# Altium schematic sheet mcu.SchDoc
size A3; SheetNumber: 1; SheetTotal: 4
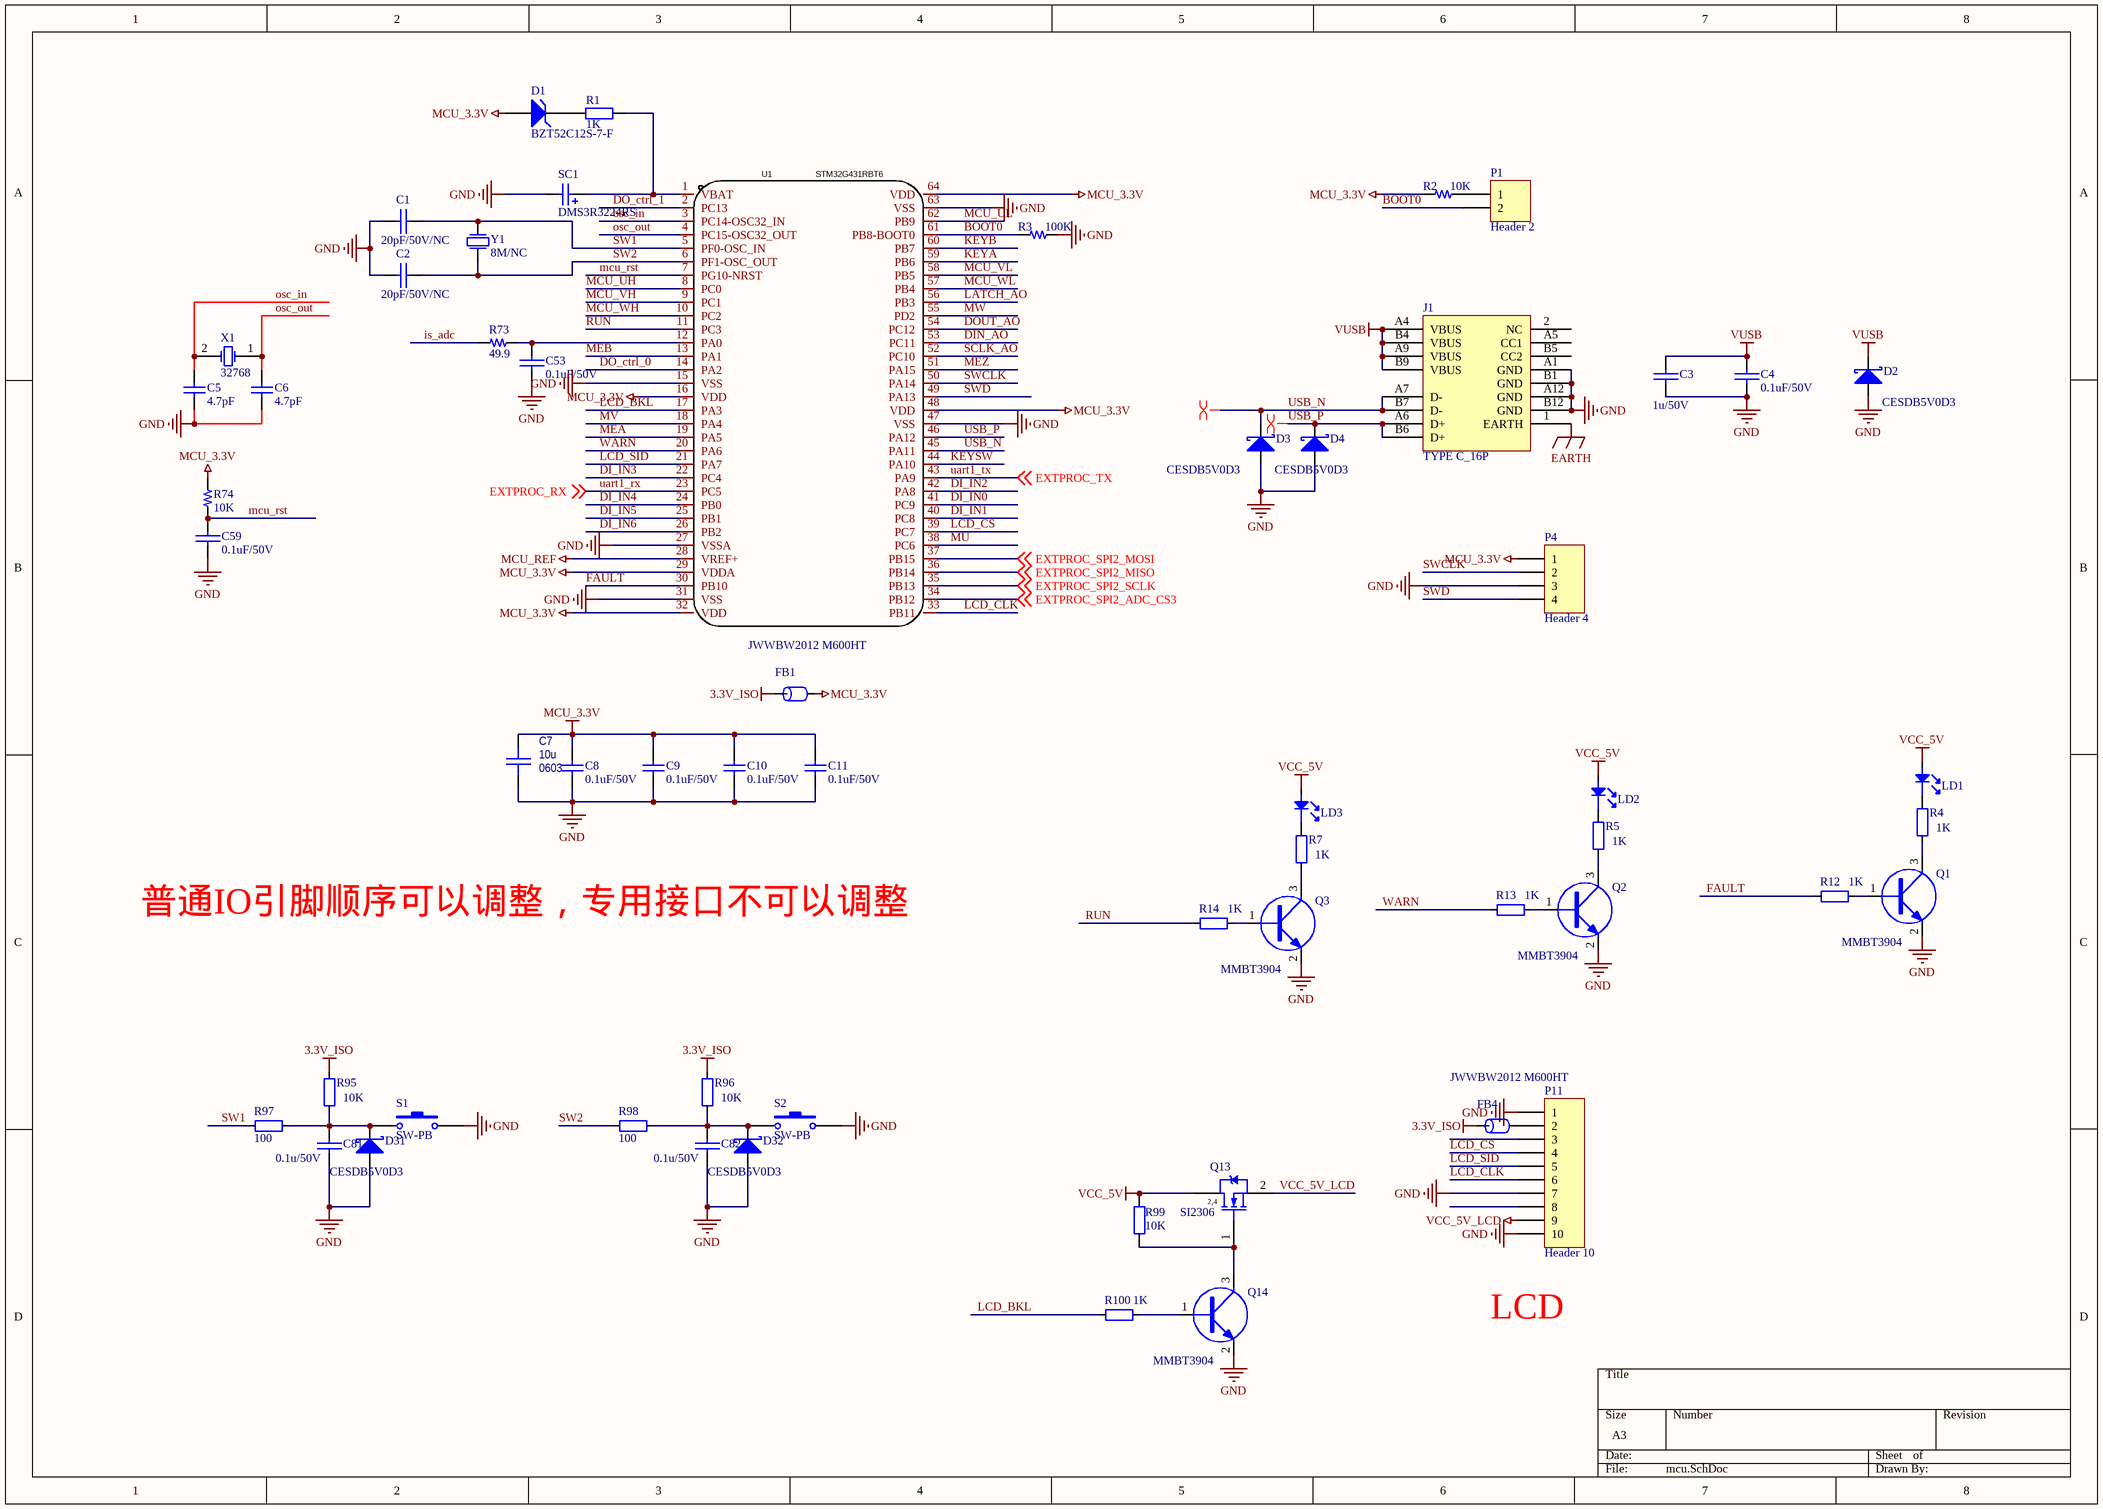
[diagram p0: mcu.SchDoc]

## Parts
C1  value 20pF/50V/NC  [0603C]  (hidden comment: 20pF/25V/NC)  (no BOM)
C2  value 20pF/50V/NC  [0603C]  (hidden comment: 20pF/25V/NC)  (no BOM)
C3  value 1u/50V  [0603C]  (hidden comment: 1uF/25V)
C4  0.1uF/50V  [0603C]
C5  4.7pF  [0603C]
C6  4.7pF  [0603C]
C7  value 10u  Package: 0603  [CAPC1608X092N_0603]  (hidden comment: Capacitor_0603)
C8  0.1uF/50V  [0603C]
C9  0.1uF/50V  [0603C]
C10  0.1uF/50V  [0603C]
C11  0.1uF/50V  [0603C]
C53  0.1uF/50V  [0603C]
C59  0.1uF/50V  [0603C]
C81  value 0.1u/50V  [0603C]  (hidden comment: 1uF/25V)
C82  value 0.1u/50V  [0603C]  (hidden comment: 1uF/25V)
D1  BZT52C12S-7-F  [DIOD-SOD323-2_V]
D2  CESDB5V0D3  [SOD323]
D3  CESDB5V0D3  [SOD323]
D4  CESDB5V0D3  [SOD323]
D31  CESDB5V0D3  [SOD323]
D32  CESDB5V0D3  [SOD323]
FB1  JWWBW2012 M600HT  [0805R]
FB4  JWWBW2012 M600HT  [0805R]
J1  TYPE C_16P  [TYPEC_16P]
LD1  LED_Green_19-217  [0603led]  (value not drawn)
LD2  LED_Green_19-217  [0603led]  (value not drawn)
LD3  LED_Green_19-217  [0603led]  (value not drawn)
P1  Header 2  [HDR1X2]
P4  Header 4  [HDR1X4]
P11  Header 10  [HDR1X10]
Q1  MMBT3904  [SOT23-3]
Q2  MMBT3904  [SOT23-3]
Q3  MMBT3904  [SOT23-3]
Q13  SI2306  [SOT23-3]
Q14  MMBT3904  [SOT23-3]
R1  1K  [0603R]  (no BOM)
R2  10K  [0603R]
R3  100K  [0603R]
R4  1K  [0603r]
R5  1K  [0603r]
R7  1K  [0603r]
R12  1K  [0603r]
R13  1K  [0603r]
R14  1K  [0603r]
R73  49.9  [0603R]
R74  10K  [0603R]
R95  10K  [0603r]
R96  10K  [0603r]
R97  100  [0603r]
R98  100  [0603r]
R99  10K  [0603R]
R100  1K  [0603r]
S1  SW-PB  [SPST-2]
S2  SW-PB  [SPST-2]
SC1  DMS3R3224RS  [CAP-TH_DMS3R3224]
U1  STM32G431RBT6  [LQFP-64]
X1  32768  [A]
Y1  8M/NC  [CRAY_5032]  (no BOM)

## Nets
3.3V_ISO: FB1.1 FB4.1 R95.1 R96.1
EARTH: J1.1(EARTH)
GND: C1.2 C2.2 C3.1 C4.1 C5.2 C6.2 C7.2 C8.1 C9.1 C10.1 C11.1 C53.1 C59.1 C81.1 C82.1 D2.1(A) D3.1(A) D4.1(A) D31.1(A) D32.1(A) J1.A1(GND) J1.A12(GND) J1.B1(GND) J1.B12(GND) P4.3 P11.1 P11.7 P11.10 Q1.2(E) Q2.2(E) Q3.2(E) Q14.2(E) R3.2 S1.2 S2.2 SC1.2 U1.15(VSS) U1.27(VSSA) U1.31(VSS) U1.47(VSS) U1.63(VSS)
MCU_3.3V: C7.1 C8.2 C9.2 C10.2 C11.2 D1.1(A) FB1.2 P4.1 R2.1 R74.1 U1.16(VDD) U1.29(VDDA) U1.32(VDD) U1.48(VDD) U1.64(VDD)
MCU_REF: U1.28(VREF+)
VCC_5V: LD1.1 LD2.1 LD3.1 Q13.3(D) R99.2
VCC_5V_LCD: P11.9 Q13.2(S)
VUSB: C3.2 C4.2 D2.2(K) J1.A4(VBUS) J1.A9(VBUS) J1.B4(VBUS) J1.B9(VBUS)
BOOT0: P1.2 R3.1 U1.61(PB8-BOOT0)
DI_IN0: U1.41(PC9)
DI_IN1: U1.40(PC8)
DI_IN2: U1.42(PA8)
DI_IN3: U1.22(PC4)
DI_IN4: U1.24(PB0)
DI_IN5: U1.25(PB1)
DI_IN6: U1.26(PB2)
DIN_AO: U1.53(PC11)
DO_ctrl_0: U1.14(PA2)
DO_ctrl_1: U1.2(PC13)
DOUT_AO: U1.54(PC12)
EXTPROC_SPI2_ADC_CS3: U1.34(PB12) ; off-sheet EXTPROC_SPI2_ADC_CS3
EXTPROC_SPI2_MISO: U1.36(PB14) ; off-sheet EXTPROC_SPI2_MISO
EXTPROC_SPI2_MOSI: U1.37(PB15) ; off-sheet EXTPROC_SPI2_MOSI
EXTPROC_SPI2_SCLK: U1.35(PB13) ; off-sheet EXTPROC_SPI2_SCLK
FAULT: R12.1 U1.30(PB10)
is_adc: R73.1
KEYA: U1.59(PB6)
KEYB: U1.60(PB7)
KEYSW: U1.44(PA10)
LATCH_AO: U1.56(PB3)
LCD_BKL: R100.1 U1.17(PA3)
LCD_CLK: P11.6 U1.33(PB11)
LCD_CS: P11.4 U1.39(PC7)
LCD_SID: P11.5 U1.21(PA7)
mcu_rst: C59.2 R74.2 U1.7(PG10-NRST)
MCU_UH: U1.8(PC0)
MCU_UL: U1.62(PB9)
MCU_VH: U1.9(PC1)
MCU_VL: U1.58(PB5)
MCU_WH: U1.10(PC2)
MCU_WL: U1.57(PB4)
MEA: U1.19(PA5)
MEB: U1.13(PA1)
MEZ: U1.51(PA15)
MU: U1.38(PC6)
MV: U1.18(PA4)
MW: U1.55(PD2)
osc_in: C5.1 U1.3(PC14-OSC32_IN) X1.2(OSC2)
osc_out: C6.1 U1.4(PC15-OSC32_OUT) X1.1(OSC1)
RUN: R14.1 U1.11(PC3)
SCLK_AO: U1.52(PC10)
SW1: C1.1 R97.1 U1.5(PF0-OSC_IN) Y1.1(P1)
SW2: C2.1 R98.1 U1.6(PF1-OSC_OUT) Y1.2(P2)
SWCLK: P4.2 U1.50(PA14)
SWD: P4.4 U1.49(PA13)
uart1_rx: U1.23(PC5) ; off-sheet EXTPROC_RX  [also labelled EXTPROC_RX]
uart1_tx: U1.43(PA9) ; off-sheet EXTPROC_TX  [also labelled EXTPROC_TX]
USB_N: D3.2(K) J1.A7(D-) J1.B7(D-) U1.45(PA11)
USB_P: D4.2(K) J1.A6(D+) J1.B6(D+) U1.46(PA12)
WARN: R13.1 U1.20(PA6)
NetC53_2: C53.2 R73.2 U1.12(PA0)
NetC81_2: C81.2 D31.2(K) R95.2 R97.2 S1.1
NetC82_2: C82.2 D32.2(K) R96.2 R98.2 S2.1
NetD1_2: D1.2(K) R1.1
NetFB4_2: FB4.2 P11.2
NetLD1_2: LD1.2 R4.1
NetLD2_2: LD2.2 R5.1
NetLD3_2: LD3.2 R7.1
NetP1_1: P1.1 R2.2
NetQ1_1: Q1.1(B) R12.2
NetQ1_3: Q1.3(C) R4.2
NetQ2_1: Q2.1(B) R13.2
NetQ2_3: Q2.3(C) R5.2
NetQ3_1: Q3.1(B) R14.2
NetQ3_3: Q3.3(C) R7.2
NetQ13_1: Q13.1(G) Q14.3(C) R99.1
NetQ14_1: Q14.1(B) R100.2
NetR1_2: R1.2 SC1.1 U1.1(VBAT)

Not connected (* = marked no-connect by the designer): J1 2(NC) A5(CC1) B5(CC2); P11 3 8

## Layout directives
differential pair: USB_N, USB_P

## Notes on the sheet
- 普通IO引脚顺序可以调整，专用接口不可以调整
- LCD
- (in symbol BUK92150-55A) 2,4

## Library data of the parts
C1-C4 C53 C59 C81 C82 = CAP
  C4 C53 C59: Value: 0.1uF/50V
C5 = Cap: Capacitor; Value: 6.8pF; Published: 8-Jun-2000; LatestRevisionDate: 17-Jul-2002; LatestRevisionNote: Re-released for DXP Platform.; PackageReference: RAD-0.3; Publisher: Altium Limited; PackageDescription: Radial Cap, Thru-Hole; 2 Leads; 0.3 in Pin Spacing
C6 = Cap: Capacitor; Published: 8-Jun-2000; LatestRevisionDate: 17-Jul-2002; LatestRevisionNote: Re-released for DXP Platform.; PackageReference: RAD-0.3; Publisher: Altium Limited; PackageDescription: Radial Cap, Thru-Hole; 2 Leads; 0.3 in Pin Spacing
C7 = Capacitor_0603: Capacitor, MLCC; Manufacturer: Murata Electronics; PartNumber: GRM188R61A106KE69D; Tolerance: [tol]; TempCo: [tempco]; Voltage Rating: [voltage]; Supplier 1: *; ComponentLink1URL: *; Supplier Part Number 1: *; ComponentLink1Description: Datasheet; SupplierDescription: CAP CER 10UF 10V X5R 0603
C8-C11 = Cap: Capacitor; Value: 22nF; Published: 8-Jun-2000; LatestRevisionDate: 17-Jul-2002; LatestRevisionNote: Re-released for DXP Platform.; PackageReference: RAD-0.3; Publisher: Altium Limited; PackageDescription: Radial Cap, Thru-Hole; 2 Leads; 0.3 in Pin Spacing
D1 = BZT52C12S-7-F: Zener Current: 5mA; Vz - Zener Voltage: 12V; Pd - Power Dissipation: 200mW; Zz - Zener Impedance: 40Ohms; Unit Weight: 0.000173oz; Voltage Temperature Coefficient: 0.25mV/C; Voltage Tolerance: 5%; Package Reference: SOD323-2; Minimum Operating Temperature: -65C; Packaging: Reel; Product Category: ZenerDiodes; Termination Style: SMD/SMT; Mounting Style: SMD/SMT; RoHS: True; Package / Case: SOD-323; Package Description: 2-Pin Surface Mount Device, Body 1.7 x 1.3 mm; Width: 1.4mm; Mounting Technology: SurfaceMount; Package URL: http://www.vishay.com/docs/71192/71192.pdf; Series: BZT52C12; Value: BZT52C12S-7-F
D2 D3 = DIODE S
D4 D31 D32 = DIODE S: Value: 0.1uF/50V
FB1 FB4 = FB: Part Field 1: 磁珠/0603/1K ohm/100MHz; FB: BLM18BD102SN1(muRata); Text Field1: FB
LD1-LD3 = LED_Green_19-217: 物料主编码(PN): 100000032; Value: 19-217/G7C-AN1P2/3T; ID: 6; 序号: 33; 物料名称: 绿色LED; 物料描述: Other,LED,绿色,0603,1.6X0.8X0.4mm,19-217/G7C-AN1P2/3T; 工作温度: –40°C to 85°C; 制造商: Everlight; 器件等级: ——; 物料类型: 特殊二极管; 规格型号(完整型号): 19-217/G7C-AN1P2/3T
P11 = Header 10: Header, 10-Pin; LatestRevisionDate: 17-Jul-2002; LatestRevisionNote: Re-released for DXP Platform.; Publisher: Altium Limited
Q1-Q3 Q14 = NPN_MMBT3904
Q13 = BUK92150-55A: Published: 8-Jun-2000; LatestRevisionDate: 17-Jul-2002; LatestRevisionNote: Re-released for DXP Platform.; DatasheetVersion: 6-Oct-1997; PackageVersion: Aug-1998; PackageReference: TSOP-6; Publisher: Altium Limited; PackageDescription: SOT-457/SC-74; 6 Leads; Body 3.1 x 3 mm, inc. leads (LxW max); ComponentLink1Description: Manufacturer Link; ComponentLink1URL: http://www.vishay.com/; ComponentLink2Description: Datasheet; ComponentLink2URL: http://www.vishay.com/docs/70192/70192.pdf
R1 = Res0805M
R2 R3 R73 R74 = R: Value: 10k/1%
R4 R5 R7 R12-R14 R100 = RES0603: 物料主编码(PN): 150000040; ID: 233; 序号: 109; 物料名称: 贴片电阻; 精度: ±1%; 规格型号(完整型号): RC1608F103CS/RC0603FR-0710KL; 物料描述: RES,贴片电阻,0603,10k,±1%,1/10W,1.6X0.8X0.45mm,RC1608F103CS/RC0603FR-0710KL; 工作温度: –55°C to 155°C; 制造商: 三星/YAGEO; 器件等级: ——; 物料类型: 表贴电阻; 参数值: 1.00E+04; Value: 1K
R95-R98 = RES0603: 物料主编码(PN): 150000040; Value: 1K; ID: 233; 序号: 109; 物料名称: 贴片电阻; 精度: ±1%; 规格型号(完整型号): RC1608F103CS/RC0603FR-0710KL; 物料描述: RES,贴片电阻,0603,10k,±1%,1/10W,1.6X0.8X0.45mm,RC1608F103CS/RC0603FR-0710KL; 工作温度: –55°C to 155°C; 制造商: 三星/YAGEO; 器件等级: ——; 物料类型: 表贴电阻; 参数值: 1.00E+04
R99 = Res2: Resistor; Value: 10R; Published: 8-Jun-2000; LatestRevisionDate: 17-Jul-2002; LatestRevisionNote: Re-released for DXP Platform.; PackageReference: AXIAL-0.4; Publisher: Altium Limited
S1 S2 = SW-PB: Switch; Published: 24-Mar-1999; LatestRevisionDate: 17-Jul-2002; LatestRevisionNote: Re-released for DXP Platform.; PackageReference: SPST-2; Publisher: Altium Limited
SC1 = Cap Pol2: Polarized Capacitor (Axial); Value: 100pF; Published: 8-Jun-2000; LatestRevisionDate: 17-Jul-2002; LatestRevisionNote: Re-released for DXP Platform.; PackageReference: POLAR0.8; Publisher: Altium Limited
U1 = STM32G431RBT6: Manufacturer: ST(意法半导体); Add into BOM: yes; Program Storage Size: 128KB; GPIO Ports Number: 52; Operating Voltage Range: 1.71V~3.6V; CPU Maximum Speed: 170MHz; ADC (Bit): 12bit; Watchdog: 有; Symbol: STM32G431RBT6; Device: STM32G431RBT6; LCSC Part Name: 带DSP和FPU的170MHz主流ARM Cortex-M4 MCU，具有128 KB Flash存储器、数学加速器和中等模拟电平集成; Supplier Part: C431633; Manufacturer Part: STM32G431RBT6; Supplier Footprint: LQFP-64(10x10); JLCPCB Part Class: Extended Part; Datasheet: https://atta.szlcsc.com/upload/public/pdf/source/20190925/C431633_8068E60CC825A086DCCD86A4BDED9458.pdf; Supplier: LCSC; Convert to PCB: yes; CPU Core: -; Operating Temperature Range: -40℃~+85℃; DAC (Bit): 12bit; Infrared Data Association: 有; Low-Voltage Detect: 有; Direct Memory Access: 有; Internal Oscillator: 有
X1 = XTAL: Crystal Oscillator; Published: 8-Jun-2000; LatestRevisionDate: 17-Jul-2002; LatestRevisionNote: Re-released for DXP Platform.; PackageReference: R38; Publisher: Altium Limited
Y1 = XTAL: Value: 8M
P1 = Header 2: Publisher: Altium Limited
P4 = Header 4: Publisher: Altium Limited